# EAGLE design digitnet-r2 (EAGLE 5.12)
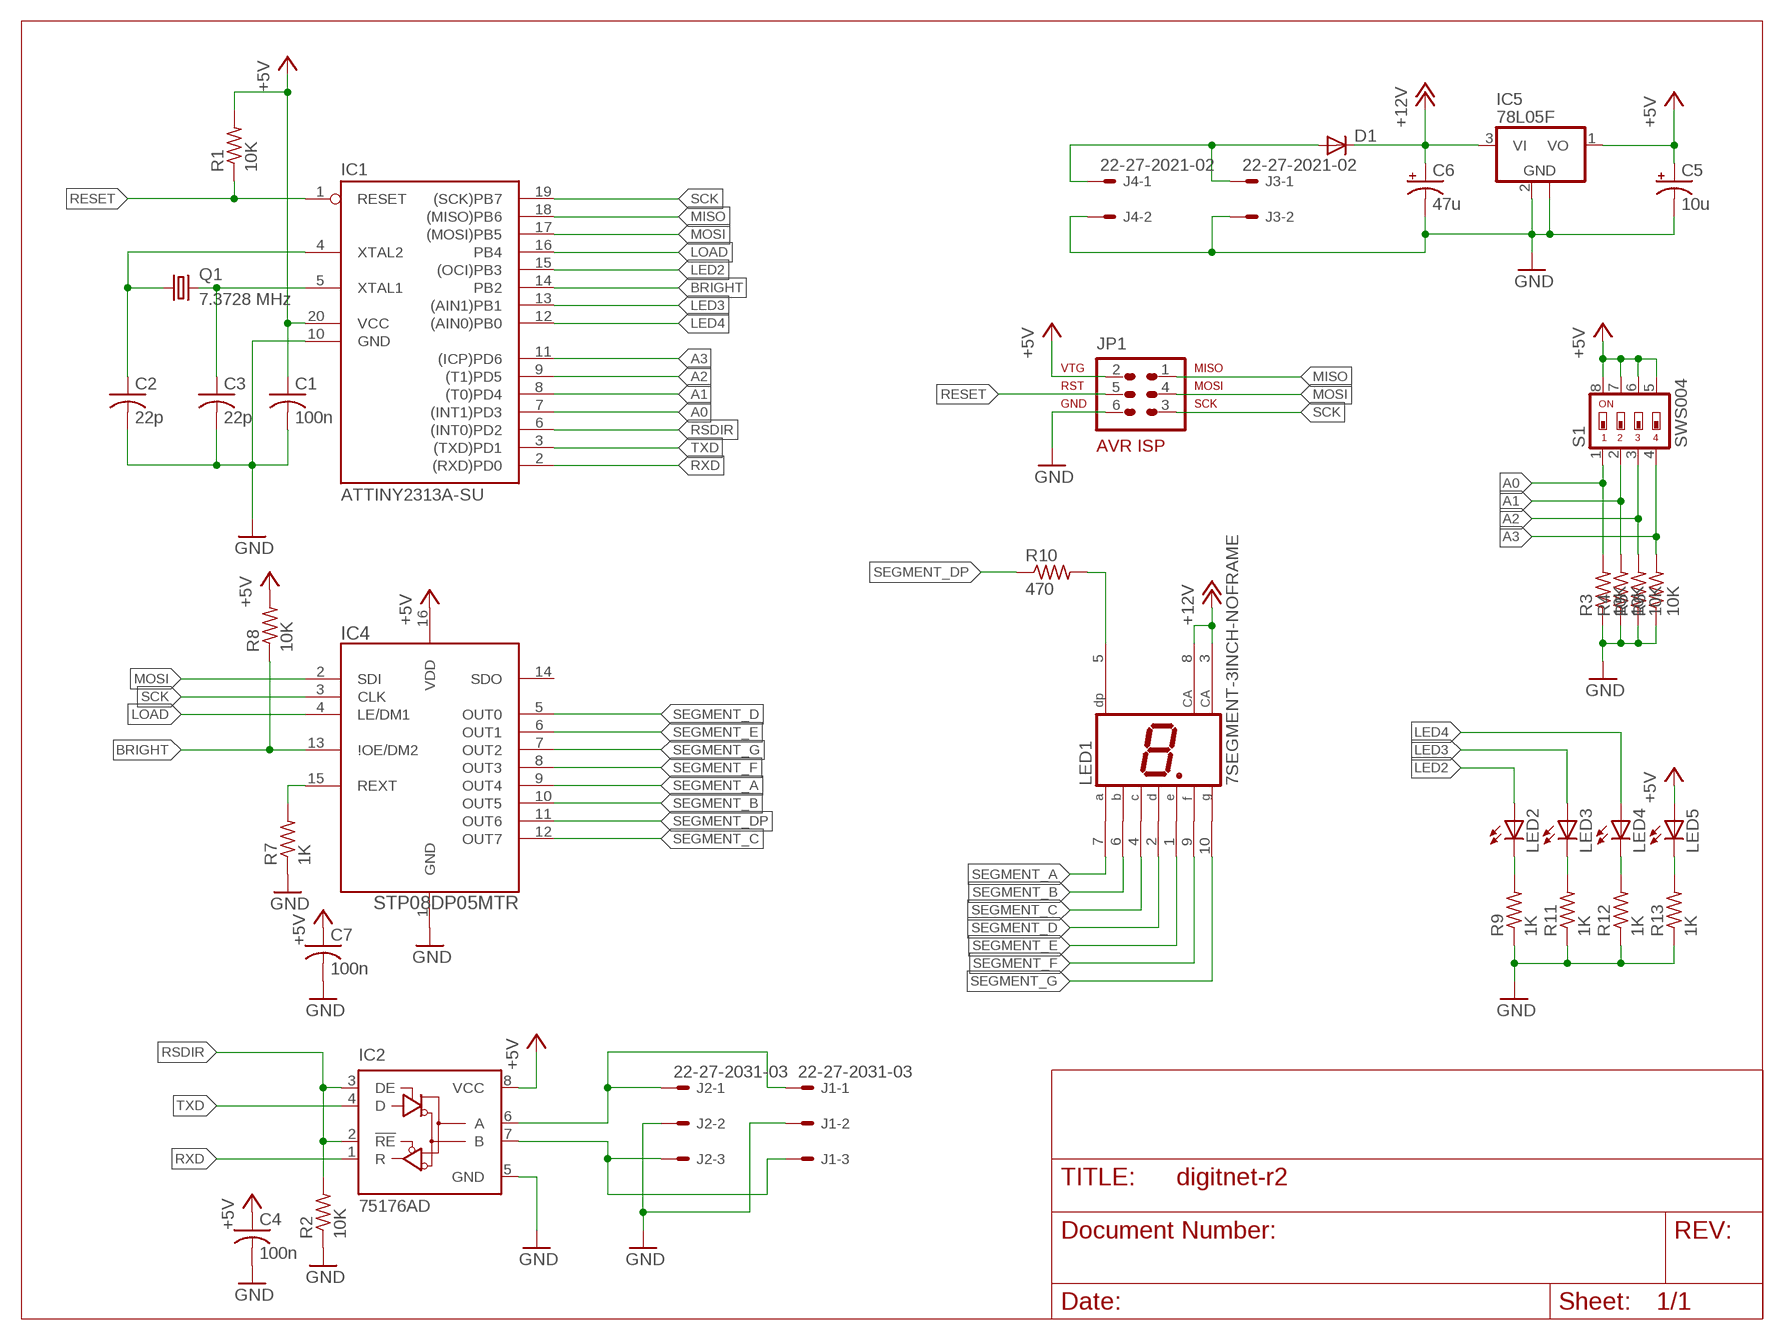
[diagram p0: schematic, sheet 1]

## Parts
C1  100n  C-USC0805  [C0805]
C2  22p  C-USC0805  [C0805]
C3  22p  C-USC0805  [C0805]
C4  100n  C-USC0805  [C0805]
C5  10u  CPOL-USB  [PANASONIC_B]
C6  47u  CPOL-USC  [PANASONIC_C]
C7  100n  C-USC0805  [C0805]
D1  DIODESMA  [SMA-DIODE]
IC1  ATTINY2313A-SU  AT90S2313S  [SO20W]
IC2  75176AD  [D_R-PDSO-G8]
IC4  STP08DP05MTR  [SOIC-16]
IC5  78L05F  [SOT89]
J1  22-27-2031-03  [6410-03]
J2  22-27-2031-03  [6410-03]
J3  22-27-2021-02  [6410-02]
J4  22-27-2021-02  [6410-02]
JP1  AVR-ISP-6  [AVR-ISP-6]
LED1  7SEGMENT-3INCH-NOFRAME  [7SEGMENT-3INCH-NOFRAME]
LED2  LEDCHIP-LED0805  [CHIP-LED0805]
LED3  LEDCHIP-LED0805  [CHIP-LED0805]
LED4  LEDCHIP-LED0805  [CHIP-LED0805]
LED5  LEDCHIP-LED0805  [CHIP-LED0805]
Q1  7.3728 MHz  CRYSTALHC49UP  [HC49UP]
R1  10K  R-US_R0805  [R0805]
R2  10K  R-US_R0805  [R0805]
R3  10K  R-US_R0805  [R0805]
R4  10K  R-US_R0805  [R0805]
R5  10K  R-US_R0805  [R0805]
R6  10K  R-US_R0805  [R0805]
R7  1K  R-US_R0805  [R0805]
R8  10K  R-US_R0805  [R0805]
R9  1K  R-US_R0805  [R0805]
R10  470  R-US_R0805  [R0805]
R11  1K  R-US_R0805  [R0805]
R12  1K  R-US_R0805  [R0805]
R13  1K  R-US_R0805  [R0805]
S1  SWS004  [SMS-004]

## Nets
+5V: C1.1 C4.1 C5.+ C7.1 IC1.20(VCC) IC2.8(VCC) IC4.16(VDD) IC5.1(VO) JP1.2 LED5.A R1.2 R8.2 S1.5 S1.6 S1.7 S1.8
+12V: C6.+ D1.C IC5.3(VI) LED1.3(CA) LED1.8(CA)
A0: IC1.7((INT1)PD3) R3.2 S1.1
A1: IC1.8((T0)PD4) R4.2 S1.2
A2: IC1.9((T1)PD5) R5.2 S1.3
A3: IC1.11((ICP)PD6) R6.2 S1.4
BRIGHT: IC1.14(PB2) IC4.13(\!OE/DM2) R8.1
GND: C1.2 C2.2 C3.2 C4.2 C5.- C6.- C7.2 IC1.10(GND) IC2.5(GND) IC4.1(GND) IC5.2(GND) IC5.2@1(GND) J1.2 J2.2 J3.2 J4.2 JP1.6 R2.1 R3.1 R4.1 R5.1 R6.1 R7.1 R9.1 R11.1 R12.1 R13.1
LED2: IC1.15((OCI)PB3) LED2.A
LED3: IC1.13((AIN1)PB1) LED3.A
LED4: IC1.12((AIN0)PB0) LED4.A
LOAD: IC1.16(PB4) IC4.4(LE/DM1)
MISO: IC1.18((MISO)PB6) JP1.1
MOSI: IC1.17((MOSI)PB5) IC4.2(SDI) JP1.4
N$1: LED1.5(DP) R10.2
N$2: LED2.C R9.2
N$3: C2.1 IC1.4(XTAL2) Q1.1
N$4: C3.1 IC1.5(XTAL1) Q1.2
N$5: IC2.6(A) J1.1 J2.1
N$6: IC2.7(B) J1.3 J2.3
N$7: LED3.C R11.2
N$8: IC4.15(REXT) R7.2
N$9: D1.A J3.1 J4.1
N$10: LED4.C R12.2
N$11: LED5.C R13.2
RESET: IC1.1(RESET) JP1.5 R1.1
RSDIR: IC1.6((INT0)PD2) IC2.2(!RE) IC2.3(DE) R2.2
RXD: IC1.2((RXD)PD0) IC2.1(R)
SCK: IC1.19((SCK)PB7) IC4.3(CLK) JP1.3
SEGMENT_A: IC4.9(OUT4) LED1.7(A)
SEGMENT_B: IC4.10(OUT5) LED1.6(B)
SEGMENT_C: IC4.12(OUT7) LED1.4(C)
SEGMENT_D: IC4.5(OUT0) LED1.2(D)
SEGMENT_DP: IC4.11(OUT6) R10.1
SEGMENT_E: IC4.6(OUT1) LED1.1(E)
SEGMENT_F: IC4.8(OUT3) LED1.9(F)
SEGMENT_G: IC4.7(OUT2) LED1.10(G)
TXD: IC1.3((TXD)PD1) IC2.4(D)
Unconnected: IC4.14(SDO)

## Library data of the parts
C1-C4 C7 = rcl:C-US: CAPACITOR, American symbol
C5 C6 = rcl:CPOL-US: POLARIZED CAPACITOR, American symbol
D1 = SparkFun:DIODE: Diode These are standard reverse protection diodes and small signal diodes. SMA package can handle up to about 1A. SOD-323 can handle about 200mA. What the SOD-323 package when ordering, there are some mfgs out there that are 5-pin packages.
IC1 = atmel-1:AT90S2313: MICROCONTROLLER 2 Kbytes FLASH 128 bytes SRAM 128 bytes EEPROM UART
IC2 = 751xx:75176A: DIFFERENTIAL BUS TRANSCEIVER Source: http://focus.ti.com/lit/ds/symlink/sn75176a.pdf
IC4 = rbg-st-ledcontrol:STP08DP05
IC5 = linear:78L*: POSITOIV-VOLTAGE REGULATORS Output up to 100 mA Source: http://focus.ti.com/lit/ds/symlink/ua78l05.pdf
J1 J2 = con-molex:22-?-03: CONNECTOR wire to board 2.54 mm (.1 inch) pitch header; OC_FARNELL: unknown; OC_NEWARK: unknown
J3 J4 = con-molex:22-?-02: CONNECTOR wire to board 2.54 mm (.1 inch) pitch header; OC_FARNELL: unknown; OC_NEWARK: unknown
JP1 = avr-5:AVR-ISP-6: AVR ISP-6 Serial Programming Header
LED1 = rbg-asiaengineer-display:7SEGMENT-3INCH
LED2-LED5 = led:LED: LED OSRAM: - CHIPLED LG R971, LG N971, LY N971, LG Q971, LY Q971, LO R971, LY R971 LH N974, LH R974 LS Q976, LO Q976, LY Q976 LO Q996 - Hyper CHIPLED LW Q18S LB Q993, LB Q99A, LB R99A - SideLED LS A670, LO A670, LY A670, LG A670, LP A670 LB A673, LV A673, LT A673, LW A673 LH A674 LY A675 LS A676, LA A676, LO A676, LY A676, LW A676 LS A679, LY A679, LG A679 - Hyper Micro SIDELED® LS Y876, LA Y876, LO Y876, LY Y876 LT Y87S - SmartLED LW L88C, LW L88S LB L89C, LB L89S, LG L890 LS L89K, LO L89K, LY L89K LS L896, LA L896, LO L896, LY L896 - TOPLED LS T670, LO T670, LY T670, LG T670, LP T670 LSG T670, LSP T670, LSY T670, LOP T670, LYG T670 LG T671, LOG T671, LSG T671 LB T673, LV T673, LT T673, LW T673 LH T674 LS T676, LA T676, LO T676, LY T676, LB T676, LH T676, LSB T676, LW T676 LB T67C, LV T67C, LT T67C, LS T67K, LO T67K, LY T67K, LW E67C LS E67B, LA E67B, LO E67B, LY E67B, LB E67C, LV E67C, LT E67C LW T67C LS T679, LY T679, LG T679 LS T770, LO T770, LY T770, LG T770, LP T770 LB T773, LV T773, LT T773, LW T773 LH T774 LS E675, LA E675, LY E675, LS T675 LS T776, LA T776, LO T776, LY T776, LB T776 LHGB T686 LT T68C, LB T68C - Hyper Mini TOPLED® LB M676 - Mini TOPLED Santana® LG M470 LS M47K, LO M47K, LY M47K Source: http://www.osram.convergy.de LUXEON: - LUMILED® LXK2-PW12-R00, LXK2-PW12-S00, LXK2-PW14-U00, LXK2-PW14-V00 LXK2-PM12-R00, LXK2-PM12-S00, LXK2-PM14-U00 LXK2-PE12-Q00, LXK2-PE12-R00, LXK2-PE12-S00, LXK2-PE14-T00, LXK2-PE14-U00 LXK2-PB12-K00, LXK2-PB12-L00, LXK2-PB12-M00, LXK2-PB14-N00, LXK2-PB14-P00, LXK2-PB14-Q00 LXK2-PR12-L00, LXK2-PR12-M00, LXK2-PR14-Q00, LXK2-PR14-R00 LXK2-PD12-Q00, LXK2-PD12-R00, LXK2-PD12-S00 LXK2-PH12-R00, LXK2-PH12-S00 LXK2-PL12-P00, LXK2-PL12-Q00, LXK2-PL12-R00 Source: www.luxeon.com KINGBRIGHT: KA-3528ASYC Source: www.kingbright.com
Q1 = crystal:CRYSTAL: CRYSTAL; OC_FARNELL: unknown; OC_NEWARK: unknown
R1-R13 = rcl:R-US_: RESISTOR, American symbol
S1 = smd-special:SWS004: SMD Dip Switch 4 pol.

## Board
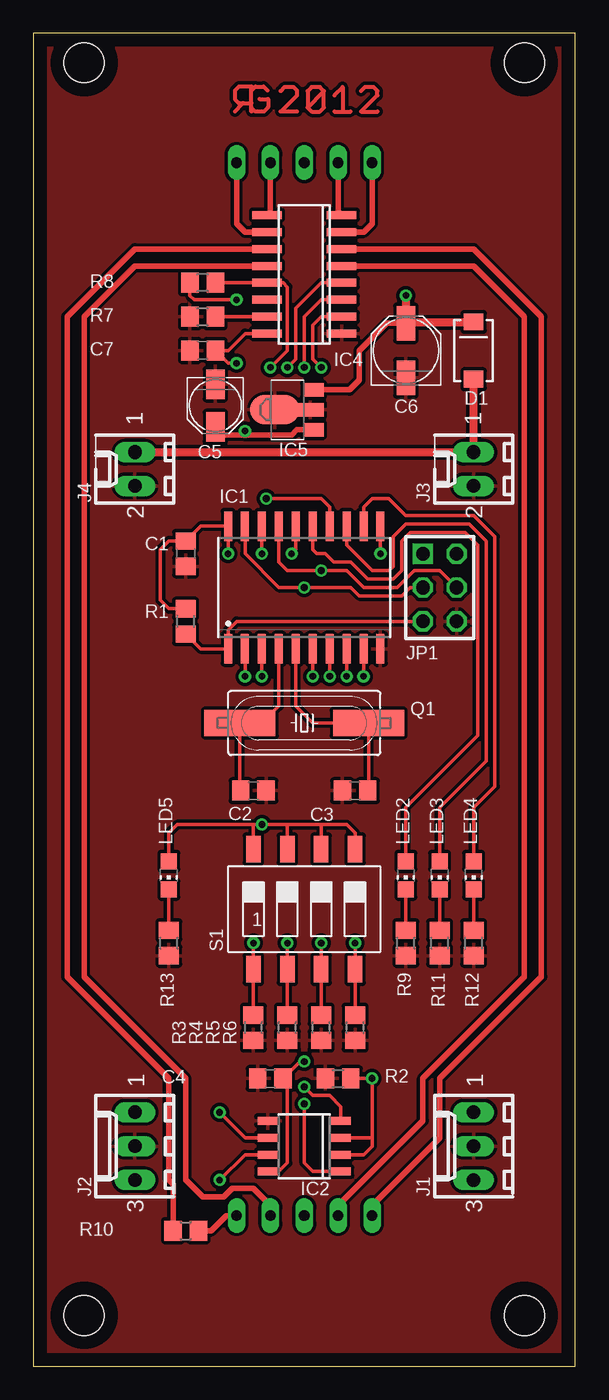
[diagram p1: board, top side]
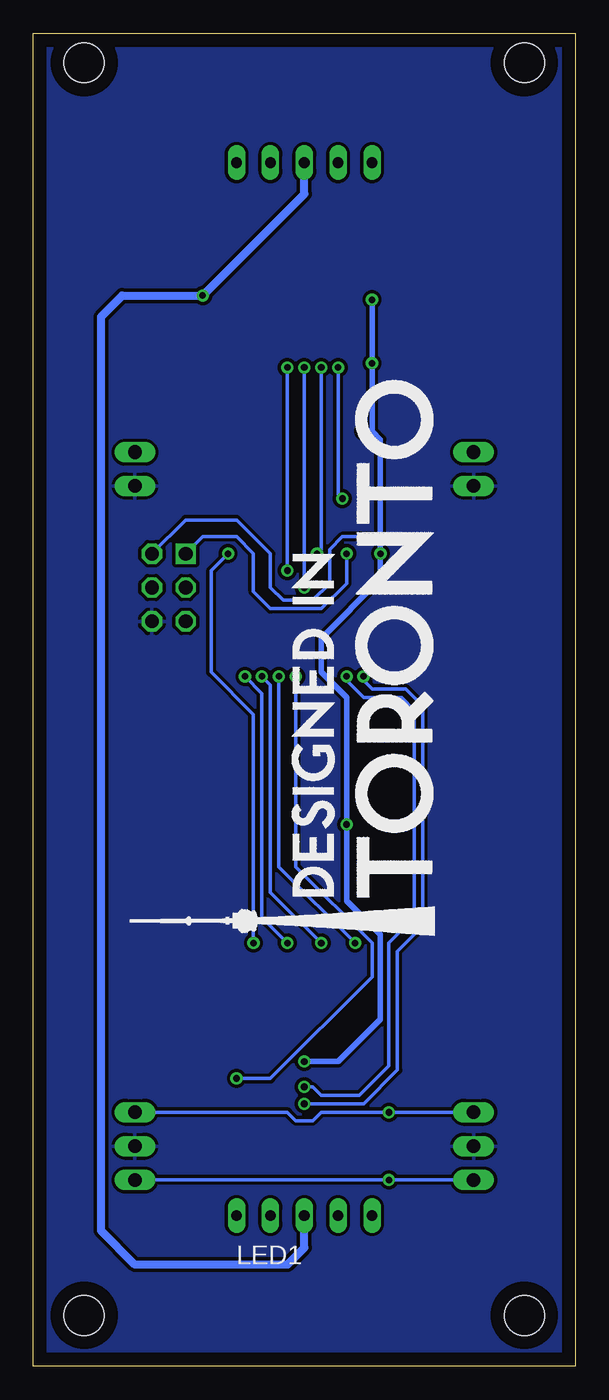
[diagram p2: board, bottom side, seen from below]

Size 40.64 x 100 mm. Coordinates in mm from the lower left corner, seen from the top.
Outline: 0,0 40.64,0 40.64,100 0,100 0,0
Copper layers (1*16): Top 0.035mm / dielectric 1.5mm / Bottom 0.035mm
Design rules "default *": minimum track width 10mil, minimum drill 19mil, track to track 10mil, track to pad 10mil, pad to pad 10mil, via to via 10mil, smd to smd 10mil, copper to edge 40mil, drill to drill 8mil, minimum pad ring 10mil, minimum via ring 8mil, stop-mask expansion 4mil, vias tented up to drill 20mil, thermal gap 10mil
Holes 3 mm at 3.81,97.79 36.83,97.79 3.81,3.81 36.83,3.81

### Footprints (pad centres in the part's own frame; a part is rotated, then mirrored left to right if it is on the bottom)
C0805 = smd 1.3 x 1.5: 1 -0.95,0; 2 0.95,0
PANASONIC_B = smd 2.2 x 1.4: + 1.6,0; - -1.6,0
PANASONIC_C = smd 2.6 x 1.4: + 2.05,0; - -2.05,0
SMA-DIODE = smd 1.27 x 1.47: A -2.15,0; C 2.15,0
SO20W = smd 0.6 x 2.2: 1 -5.715,-4.6; 2 -4.445,-4.6; 3 -3.175,-4.6; 4 -1.905,-4.6; 5 -0.635,-4.6; 6 0.635,-4.6; 7 1.905,-4.6; 8 3.175,-4.6; 9 4.445,-4.6; 10 5.715,-4.6; 11 5.715,4.6; 12 4.445,4.6; 13 3.175,4.6; 14 1.905,4.6; 15 0.635,4.6; 16 -0.635,4.6; 17 -1.905,4.6; 18 -3.175,4.6; 19 -4.445,4.6; 20 -5.715,4.6
D_R-PDSO-G8 = smd 0.6 x 1.5: 1 -1.905,-2.75; 2 -0.635,-2.75; 3 0.635,-2.75; 4 1.905,-2.75; 5 1.905,2.75; 6 0.635,2.75; 7 -0.635,2.75; 8 -1.905,2.75
SOIC-16 = smd 0.6 x 2.2: 1 -3.81,-2.8; 2 -2.54,-2.8; 3 -1.27,-2.8; 4 0,-2.8; 5 1.27,-2.8; 6 2.54,-2.8; 7 3.81,-2.8; 8 5.08,-2.8; 9 5.08,2.8; 10 3.81,2.8; 11 2.54,2.8; 12 1.27,2.8; 13 0,2.8; 14 -1.27,2.8; 15 -2.54,2.8; 16 -3.81,2.8
SOT89 = smd 1 x 1.5: 1 -1.499,-1.981; 3 1.499,-1.981 | smd 1 x 2: 2 0,-1.727 | smd 2.2 x 3.7: 2@1 0,0.94
6410-03 = drill 1.016 long: 1 2.54,0; 2 0,0; 3 -2.54,0
6410-02 = drill 1.016 long: 1 1.27,0; 2 -1.27,0
AVR-ISP-6 = drill 1.016 square: 1 -2.54,-1.27 | drill 1.016 octagon: 2 -2.54,1.27; 3 0,-1.27; 4 0,1.27; 5 2.54,-1.27; 6 2.54,1.27
7SEGMENT-3INCH-NOFRAME = drill 0.8 long: 1 -5.08,-39.5; 2 -2.54,-39.5; 3 0,-39.5; 4 2.54,-39.5; 5 5.08,-39.5; 6 5.08,39.5; 7 2.54,39.5; 8 0,39.5; 9 -2.54,39.5; 10 -5.08,39.5
CHIP-LED0805 = smd 1.2 x 1.2: A 0,-1.05; C 0,1.05
HC49UP = smd 5.334 x 1.93: 1 -4.826,0; 2 4.826,0
R0805 = smd 1.3 x 1.5: 1 -0.95,0; 2 0.95,0
SMS-004 = smd 1.092 x 2.007: 1 -3.81,-4.496; 2 -1.27,-4.496; 3 1.27,-4.496; 4 3.81,-4.496; 5 3.81,4.496; 6 1.27,4.496; 7 -1.27,4.496; 8 -3.81,4.496

### Placement (x,y rotation side)
C1  11.43,60.96 270 top
C2  16.51,43.18 0 top
C3  24.13,43.18 180 top
C4  17.78,21.59 180 top
C5  13.65,72.07 270 top
C6  27.94,76.2 90 top
C7  12.7,76.2 180 top
D1  33.02,76.2 90 top
IC1  20.32,58.42 0 top
IC2  20.32,16.51 90 top
IC4  20.32,81.28 90 top
IC5  19.05,71.75 90 top
J1  33.02,16.51 90 top
J2  7.62,16.51 90 top
J3  33.02,67.31 90 top
J4  7.62,67.31 90 top
JP1  30.48,58.42 270 top
LED1  20.32,50.8 0 bottom
LED2  27.94,36.83 180 top
LED3  30.48,36.83 180 top
LED4  33.02,36.83 180 top
LED5  10.16,36.83 180 top
Q1  20.32,48.26 0 top
R1  11.43,55.88 90 top
R2  22.86,21.59 0 top
R3  16.51,25.4 90 top
R4  19.05,25.4 90 top
R5  21.59,25.4 90 top
R6  24.13,25.4 90 top
R7  12.7,78.74 0 top
R8  12.7,81.28 180 top
R9  27.94,31.75 90 top
R10  11.43,10.16 0 top
R11  30.48,31.75 90 top
R12  33.02,31.75 90 top
R13  10.16,31.75 90 top
S1  20.32,34.29 0 top
U$1  [RGLOGO_SMALL_2012]  16.51,93.98 0 top
U$2  [DESIGNED_IN_TORONTO]  10.16,31.75 90 bottom

### Tracks (layer width: path | path; a pad name or v marks a point on that pad's centre or on a via)
+5V  (via drill 0.5)
  Top 0.254: IC2.8 18.41,14.61 19.05,15.24 19.05,21.27 C4.1 20,22.86 v20.32,22.86 | S1.5 24.13,40.01 23.49,40.64 21.59,40.64 | 19.05,40.64 v17.15,40.64 16.51,40.64 | 19.05,40.64 21.59,40.64 | 16.51,40.64 S1.8 | 19.05,40.64 S1.7 | 21.59,40.64 S1.6 | v14.6,60.96 IC1.20 12.54,63.02 C1.1 10.16,61.91 9.53,61.28 9.53,57.47 10.16,56.83 R1.2 | v15.24,80.01 12.06,80.01 11.75,80.33 R8.2 | IC4.16 15.87,77.47 14.6,76.2 C7.1 14.6,75.25 v15.24,75.25 | LED5.A 10.16,40.01 10.79,40.64 16.51,40.64
  Top 0.406: IC5.1 19.77,70.26 19.37,69.85 15.87,69.85 | v15.87,70.17 15.87,69.85 | 15.87,69.85 14.28,69.85 C5.+
  Bottom 0.254: JP1.2 29.21,63.5 25.4,63.5 22.86,60.96 22.86,58.42 21.91,57.47 19.69,57.47 18.41,58.74 18.41,61.28 17.46,62.23 14.6,62.23
  Bottom 0.406: v20.32,22.86 17.78,22.86 14.6,26.04 14.6,32.38 17.15,34.92 v17.15,40.64 17.15,50.16 19.05,52.07 19.05,54.61 14.6,59.05 v14.6,60.96 14.6,62.23 14.6,69.53 15.24,70.17 | v15.24,80.01 v15.24,75.25 15.24,70.17 | 15.24,70.17 v15.87,70.17
+12V  (via drill 0.5)
  Top 0.406: IC5.3 23.72,73.25 24.45,73.98 24.45,76.2 26.5,78.25 C6.+
  Top 0.61: D1.C 28.49,78.35 C6.+ v27.94,80.33
  Bottom 0.61: LED1.8 20.32,87.95 v27.94,80.33 33.97,80.33 35.56,78.74 35.56,10.16 33.02,7.62 21.59,7.62 20.32,8.89 LED1.3
A0  (via drill 0.5)
  Top 0.254: R3.2 S1.1 v16.51,31.75 | v22.23,51.75 IC1.7
  Bottom 0.254: v16.51,31.75 22.23,37.47 v22.23,51.75
A1  (via drill 0.5)
  Top 0.254: R4.2 S1.2 v19.05,31.75 | v23.49,51.75 IC1.8
  Bottom 0.254: v19.05,31.75 22.86,35.56 22.86,51.12 v23.49,51.75
A2  (via drill 0.5)
  Top 0.254: R5.2 S1.3 v21.59,31.75 | v24.77,51.75 IC1.9
  Bottom 0.254: v21.59,31.75 23.49,33.66 23.49,50.48 v24.77,51.75
A3  (via drill 0.5)
  Top 0.254: R6.2 S1.4 v24.13,31.75 | v26.03,60.96 IC1.11
  Bottom 0.254: v24.13,31.75 24.13,48.9 27.3,52.07 27.3,59.69 v26.03,60.96
BRIGHT  (via drill 0.5)
  Top 0.254: R8.1 IC4.13 18.73,81.28 19.05,80.96 19.05,76.2 v17.78,74.93 | IC1.14 22.23,64.45 21.59,65.09 v17.46,65.09
  Bottom 0.254: v17.46,65.09 17.78,65.41 v17.78,74.93
GND
  pour Top: 0,101.6 41.91,101.6 41.91,-1.27 0,-1.27
  pour Bottom: 0,101.6 41.91,101.6 41.91,-1.27 0,-1.27
LED2
  Top 0.254: IC1.15 20.95,61.28 21.27,60.96 21.91,60.96 22.54,60.33 23.81,60.33 25.08,59.05 26.99,59.05 27.62,59.69 27.62,61.91 28.26,62.55 32.39,62.55 33.34,61.59 33.34,47.31 27.94,41.91 LED2.A
LED3
  Top 0.254: IC1.13 23.49,61.59 25.4,59.69 26.67,59.69 26.99,60.01 26.99,62.23 27.94,63.18 32.7,63.18 33.97,61.91 33.97,45.4 30.48,41.91 LED3.A
LED4
  Top 0.254: IC1.12 24.77,64.45 25.4,65.09 26.67,65.09 27.94,63.82 33.02,63.82 34.61,62.23 34.61,43.5 33.02,41.91 LED4.A
LOAD  (via drill 0.5)
  Top 0.254: IC4.4 21.59,81.28 19.69,79.38 19.69,75.56 v19.05,74.93 | IC1.16 19.69,61.28 v19.37,60.96
  Bottom 0.254: v19.37,60.96 19.05,61.28 v19.05,74.93
MISO  (via drill 0.5)
  Top 0.254: v17.15,60.96 IC1.18
  Bottom 0.254: v17.15,60.96 17.15,58.74 19.05,56.83 22.86,56.83 24.13,58.1 24.13,60.96 25.4,62.23 27.94,62.23 JP1.1
MOSI  (via drill 0.5)
  Top 0.254: JP1.4 30.48,59.69 28.58,59.69 27.3,58.42 24.77,58.42 23.49,59.69 v21.59,59.69 19.05,59.69 18.41,60.33 IC1.17 | IC4.2 21.59,78.74 20.95,78.11 20.95,75.56 v21.59,74.93
  Bottom 0.254: v21.59,59.69 v21.59,74.93
N$1
  Top 0.406: LED1.5 14.47,11.3 13.33,10.16 R10.2
N$2
  Top 0.254: R9.2 LED2.C
N$3
  Top 0.254: IC1.4 18.41,49.53 17.15,48.26 Q1.1 15.49,43.25 C2.1
N$4
  Top 0.254: IC1.5 19.69,49.53 20.95,48.26 Q1.2 25.15,43.25 C3.1
N$5  (via drill 0.5)
  Top 0.254: IC2.6 15.87,17.14 v13.97,19.05
  Bottom 0.254: J2.1 v13.97,19.05 19.05,19.05 19.69,18.41 20.95,18.41 21.59,19.05 J1.1
N$6  (via drill 0.5)
  Top 0.254: IC2.7 15.87,15.88 v13.97,13.97
  Bottom 0.254: J2.3 v13.97,13.97 J1.3
N$7
  Top 0.254: R11.2 LED3.C
N$8
  Top 0.254: R7.2 IC4.15
N$9
  Top 0.61: D1.A J3.1 J4.1
N$10
  Top 0.254: R12.2 LED4.C
N$11
  Top 0.254: R13.2 LED5.C
RESET
  Top 0.254: R1.1 12.54,53.82 IC1.1 14.6,55.24 15.24,55.88 JP1.5
RSDIR  (via drill 0.5)
  Top 0.254: IC2.2 24.77,15.88 25.4,16.51 25.4,17.14 | 25.4,17.14 IC2.3 | v20.95,51.75 IC1.6 | R2.2 v25.4,21.59 25.4,17.14
  Bottom 0.254: v20.95,51.75 20.95,37.47 15.24,31.75 15.24,29.21 22.86,21.59 v25.4,21.59
RXD  (via drill 0.5)
  Top 0.254: v15.87,51.75 IC1.2 | v20.32,19.68 20.32,15.24 20.95,14.61 IC2.1
  Bottom 0.254: v15.87,51.75 15.87,51.44 15.24,50.8 12.7,50.8 11.43,49.53 11.43,33.02 13.33,31.11 13.33,22.23 15.87,19.68 v20.32,19.68
SCK  (via drill 0.5)
  Top 0.254: JP1.3 28.26,58.42 27.62,57.78 24.45,57.78 23.81,58.42 v20.32,58.42 18.41,58.42 15.87,60.96 IC1.19 | IC4.3 21.59,80.01 20.32,78.74 v20.32,74.93
  Bottom 0.254: v20.32,58.42 v20.32,74.93
SEGMENT_A
  Top 0.406: LED1.7 17.78,86.62 IC4.9
SEGMENT_B
  Top 0.406: IC4.10 15.87,85.09 15.24,85.72 LED1.6
SEGMENT_C
  Top 0.406: LED1.4 17.78,12.06 16.51,13.34 14.92,13.34 14.29,12.7 12.7,12.7 11.43,13.97 11.43,21.59 3.81,29.21 3.81,78.74 7.62,82.55 IC4.12
SEGMENT_D
  Top 0.406: LED1.2 22.86,12.06 29.21,18.41 29.21,21.59 36.83,29.21 36.83,78.74 33.02,82.55 IC4.5
SEGMENT_DP
  Top 0.406: IC4.11 7.62,83.82 2.54,78.74 2.54,29.21 10.16,21.59 10.16,13.97 10.48,13.65 R10.1
SEGMENT_E
  Top 0.406: IC4.6 33.02,83.82 38.1,78.74 38.1,29.21 30.48,21.59 30.48,17.14 25.4,12.06 LED1.1
SEGMENT_F
  Top 0.406: LED1.9 22.86,86.62 IC4.8
SEGMENT_G
  Top 0.406: IC4.7 24.77,85.09 25.4,85.72 LED1.10
TXD  (via drill 0.5)
  Top 0.254: v17.15,51.75 IC1.3 | v20.32,20.95 20.95,20.32 22.23,20.32 23.07,19.48 IC2.4
  Bottom 0.254: v17.15,51.75 17.15,51.44 15.87,50.16 13.02,50.16 12.06,49.21 12.06,33.66 13.97,31.75 13.97,22.54 16.19,20.32 19.05,20.32 19.69,20.95 v20.32,20.95